# EAGLE schematic full (EAGLE 9.5.2)
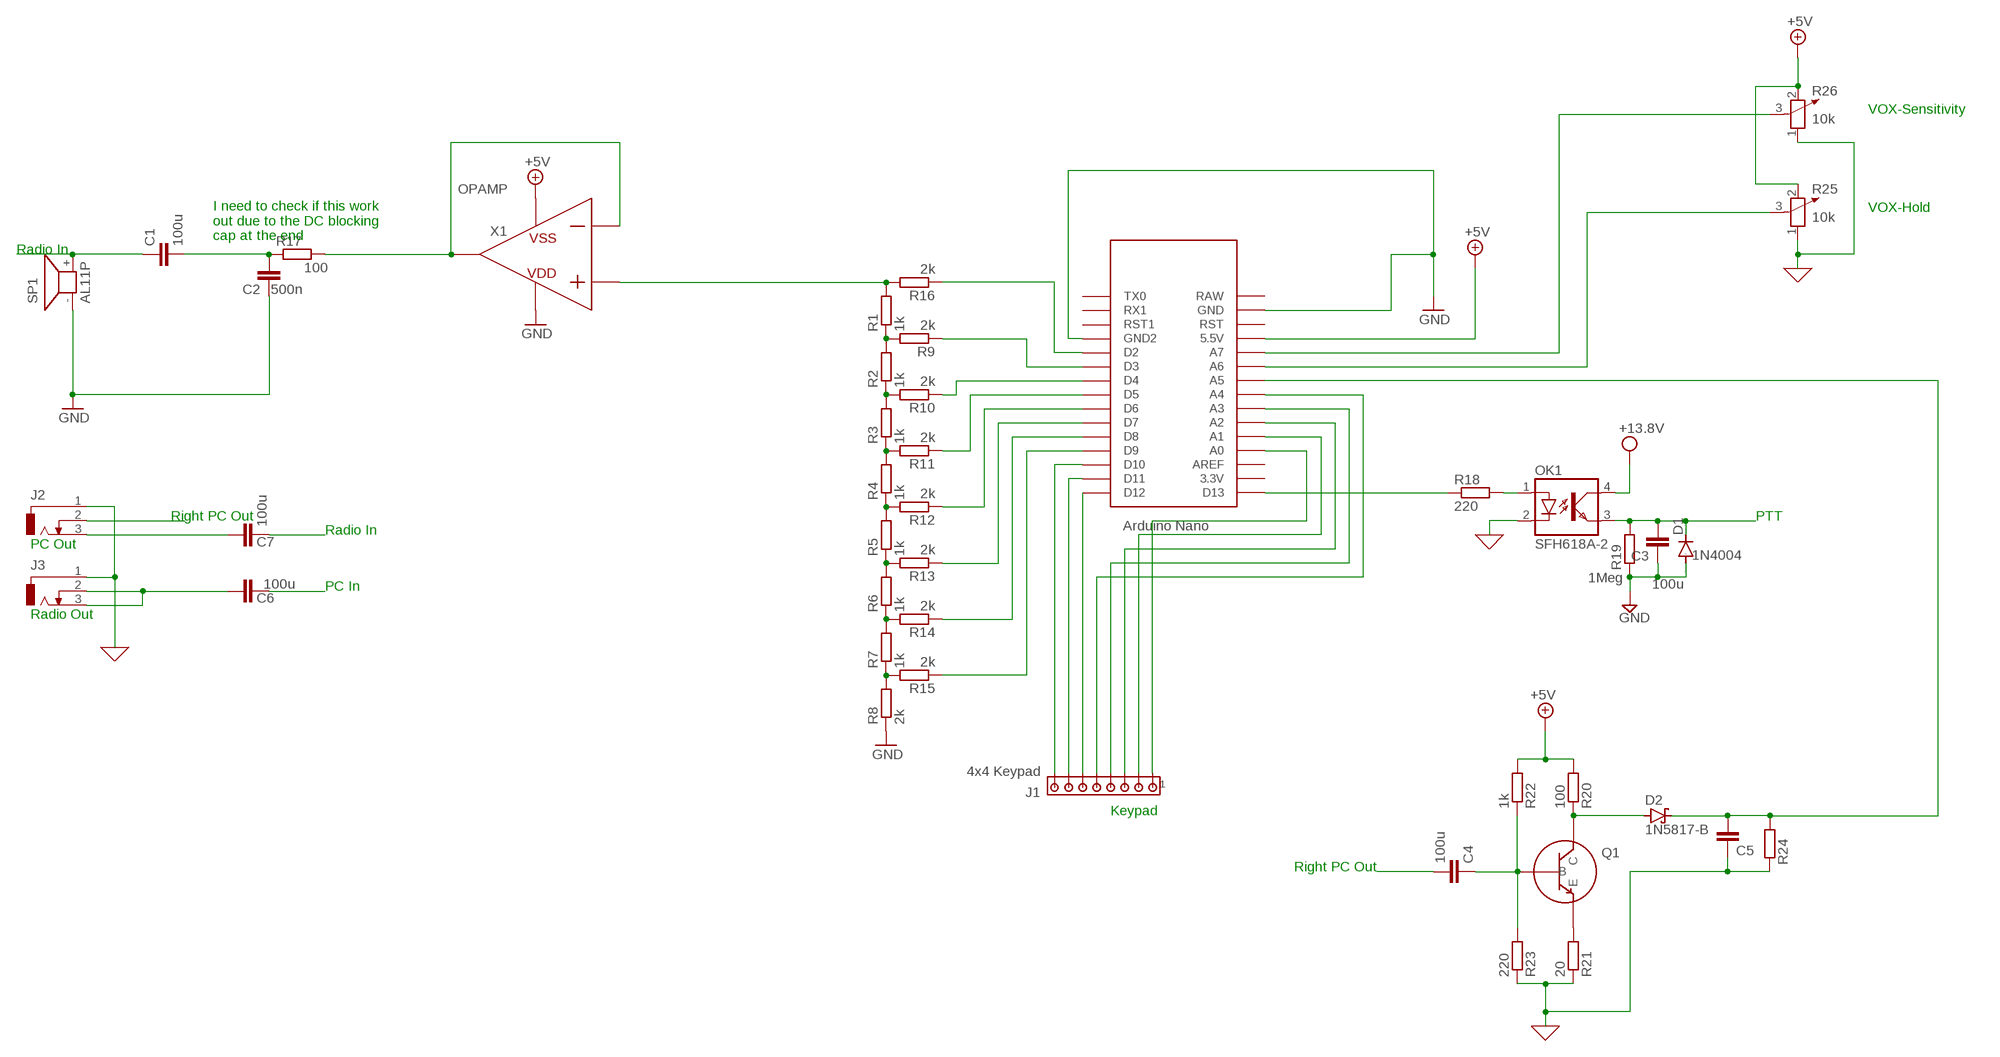
[diagram p0: schematic, sheet 1]

## Parts
C1  100u  C-EU025-024X044  [C025-024X044]
C2  500n  C-EU025-025X050  [C025-025X050]
C3  100u  C-EU025-025X050  [C025-025X050]
C4  100u  C-EU025-024X044  [C025-024X044]
C5  C-EU025-024X044  [C025-024X044]
C6  100u  C-EU025-025X050  [C025-025X050]
C7  100u  C-EU025-025X050  [C025-025X050]
D1  1N4004  [DO41-10]
D2  1N5817-B  [DO41-7.6]
J1  4x4 Keypad  MTA08-100  [10X08MTA]
J2  DCJ0303  [DCJ0303]
J3  DCJ0303  [DCJ0303]
OK1  SFH618A-2  [DIP4]
Q1  BJT_NPN  (no package)
R1  1k  R-EU_0204/7  [0204/7]
R2  1k  R-EU_0204/7  [0204/7]
R3  1k  R-EU_0204/7  [0204/7]
R4  1k  R-EU_0204/7  [0204/7]
R5  1k  R-EU_0204/7  [0204/7]
R6  1k  R-EU_0204/7  [0204/7]
R7  1k  R-EU_0204/7  [0204/7]
R8  2k  R-EU_0204/7  [0204/7]
R9  2k  R-EU_0204/7  [0204/7]
R10  2k  R-EU_0204/7  [0204/7]
R11  2k  R-EU_0204/7  [0204/7]
R12  2k  R-EU_0204/7  [0204/7]
R13  2k  R-EU_0204/7  [0204/7]
R14  2k  R-EU_0204/7  [0204/7]
R15  2k  R-EU_0204/7  [0204/7]
R16  2k  R-EU_0204/7  [0204/7]
R17  100  R-EU_0204/7  [0204/7]
R18  220  R-EU_0204/7  [0204/7]
R19  1Meg  R-EU_0204/7  [0204/7]
R20  100  R-EU_0207/10  [0207/10]
R21  20  R-EU_0207/10  [0207/10]
R22  1k  R-EU_0207/10  [0207/10]
R23  220  R-EU_0207/10  [0207/10]
R24  R-EU_0204/7  [0204/7]
R25  10k  POTENTIOMETER_PT-10  [PT-10]
R26  10k  POTENTIOMETER_PT-10  [PT-10]
SP1  AL11P  [AL11P]
U$1  NANO  [NANO]
X1  OPAMP  (no package)

## Nets
0: C5.1 J2.1 J3.1 OK1.2(C) R21.1 R23.1 R24.1 R25.1 R26.1 ; supply symbol labelled GND
+5V: R20.2 R22.2 R25.2 R26.2 U$1.5V(5.5V) X1.VSS
GND: C2.1 C3.1 D1.A R8.1 R19.1 SP1.- U$1.GND U$1.GND1(GND2) X1.VDD
N$1: R1.1 R2.2 R9.2
N$2: R2.1 R3.2 R10.2
N$3: R3.1 R4.2 R11.2
N$4: R4.1 R5.2 R12.2
N$5: R5.1 R6.2 R13.2
N$6: R6.1 R7.2 R14.2
N$7: R7.1 R8.2 R15.2
N$8: R1.2 R16.2 X1.P
N$9: R16.1 U$1.D2
N$10: R9.1 U$1.D3
N$11: R10.1 U$1.D4
N$12: R11.1 U$1.D5
N$13: R12.1 U$1.D6
N$14: R13.1 U$1.D7
N$15: R14.1 U$1.D8
N$16: J1.1 U$1.A0
N$17: R17.2 X1.N X1.VOUT
N$18: C1.1 SP1.+
N$19: J1.8 U$1.D10
N$20: J1.7 U$1.D11
N$21: J1.6 U$1.D12
N$22: J1.5 U$1.A4
N$23: R18.1 U$1.D13
N$24: J1.2 U$1.A1
N$25: J1.3 U$1.A2
N$26: J1.4 U$1.A3
N$27: R15.1 U$1.D9
N$28: D2.A Q1.C R20.1
N$29: C1.2 C2.2 R17.1
N$30: OK1.1(A) R18.2
N$31: C3.2 D1.C OK1.3(EMIT) R19.2
N$32: C5.2 D2.C R24.2 U$1.A5
N$33: Q1.E R21.2
N$34: C4.1 Q1.B R22.1 R23.2
N$35: C4.2
N$36: C7.1 J2.3
N$37: J2.2
N$38: C6.1 J3.2 J3.3
N$39: C6.2
N$40: C7.2
N$41: R26.3 U$1.A7
N$42: R25.3 U$1.A6
VCC: OK1.4(COL) ; supply symbol labelled +13.8V
Unconnected: U$1.3.3V U$1.AREF U$1.ICSP1 U$1.ICSP2 U$1.ICSP3 U$1.ICSP4 U$1.ICSP5 U$1.ICSP6 U$1.RAW U$1.RST U$1.RST1 U$1.RX1 U$1.TX0

## Notes on the sheet
- VOX-Sensitivity
- VOX-Hold
- I need to check if this work
  out due to the DC blocking
  cap at the end
- Radio In
- Right PC Out | PTT
- Radio In
- PC Out
- PC In
- Radio Out
- Keypad
- Right PC Out

## Library data of the parts
C1-C7 = rcl:C-EU: CAPACITOR, European symbol; SPICEPREFIX: C
D1 = diode:1N4004: DIODE general purpose rectifier, 1 A
D2 = diode:1N581*: 1.0A SCHOTTKY BARRIER RECTIFIER Source: http://www.diodes.com/datasheets/ds23001.pdf
J1 = con-amp:MTA08-100: AMP connector
J2 J3 = con-jack:DCJ0303: DC POWER JACK Source: DCJ0303.pdf; OC_FARNELL: unknown; OC_NEWARK: unknown
OK1 = optocoupler:SFH618?*: Optocoupler, Phototransistor Output, Low Input Current Source: Data sheet <http://www.vishay.com/docs/83673/sfh618.pdf>; MF: VISHAY/TELEFUNKEN; MPN: SFH618A-2; OC_FARNELL: 6424855; OC_NEWARK: 21H7744
Q1 = ngspice-simulation:BJT_NPN: Bipolar NPN Transistor
R1-R24 = rcl:R-EU_: RESISTOR, European symbol; SPICEPREFIX: R
R25 R26 = rcl:POTENTIOMETER_: Potentiometer; SPICEMODEL: POT; SPICEPREFIX: X
SP1 = buzzer:AL11P: SPEAKER Source: Buerklin; OC_FARNELL: unknown; OC_NEWARK: unknown
U$1 = Arduino-clone:NANO: Arduino Nano
X1 = ngspice-simulation:OPAMP: Operational amplifier with power pins